# Altium schematic sheet MCU_1.SchDoc
size 420 x 297 mm; DocumentNumber: АЕСН.466369.100Э3; SheetNumber: 5; SheetTotal: x; DocumentName: Sheet1.SCHDOC
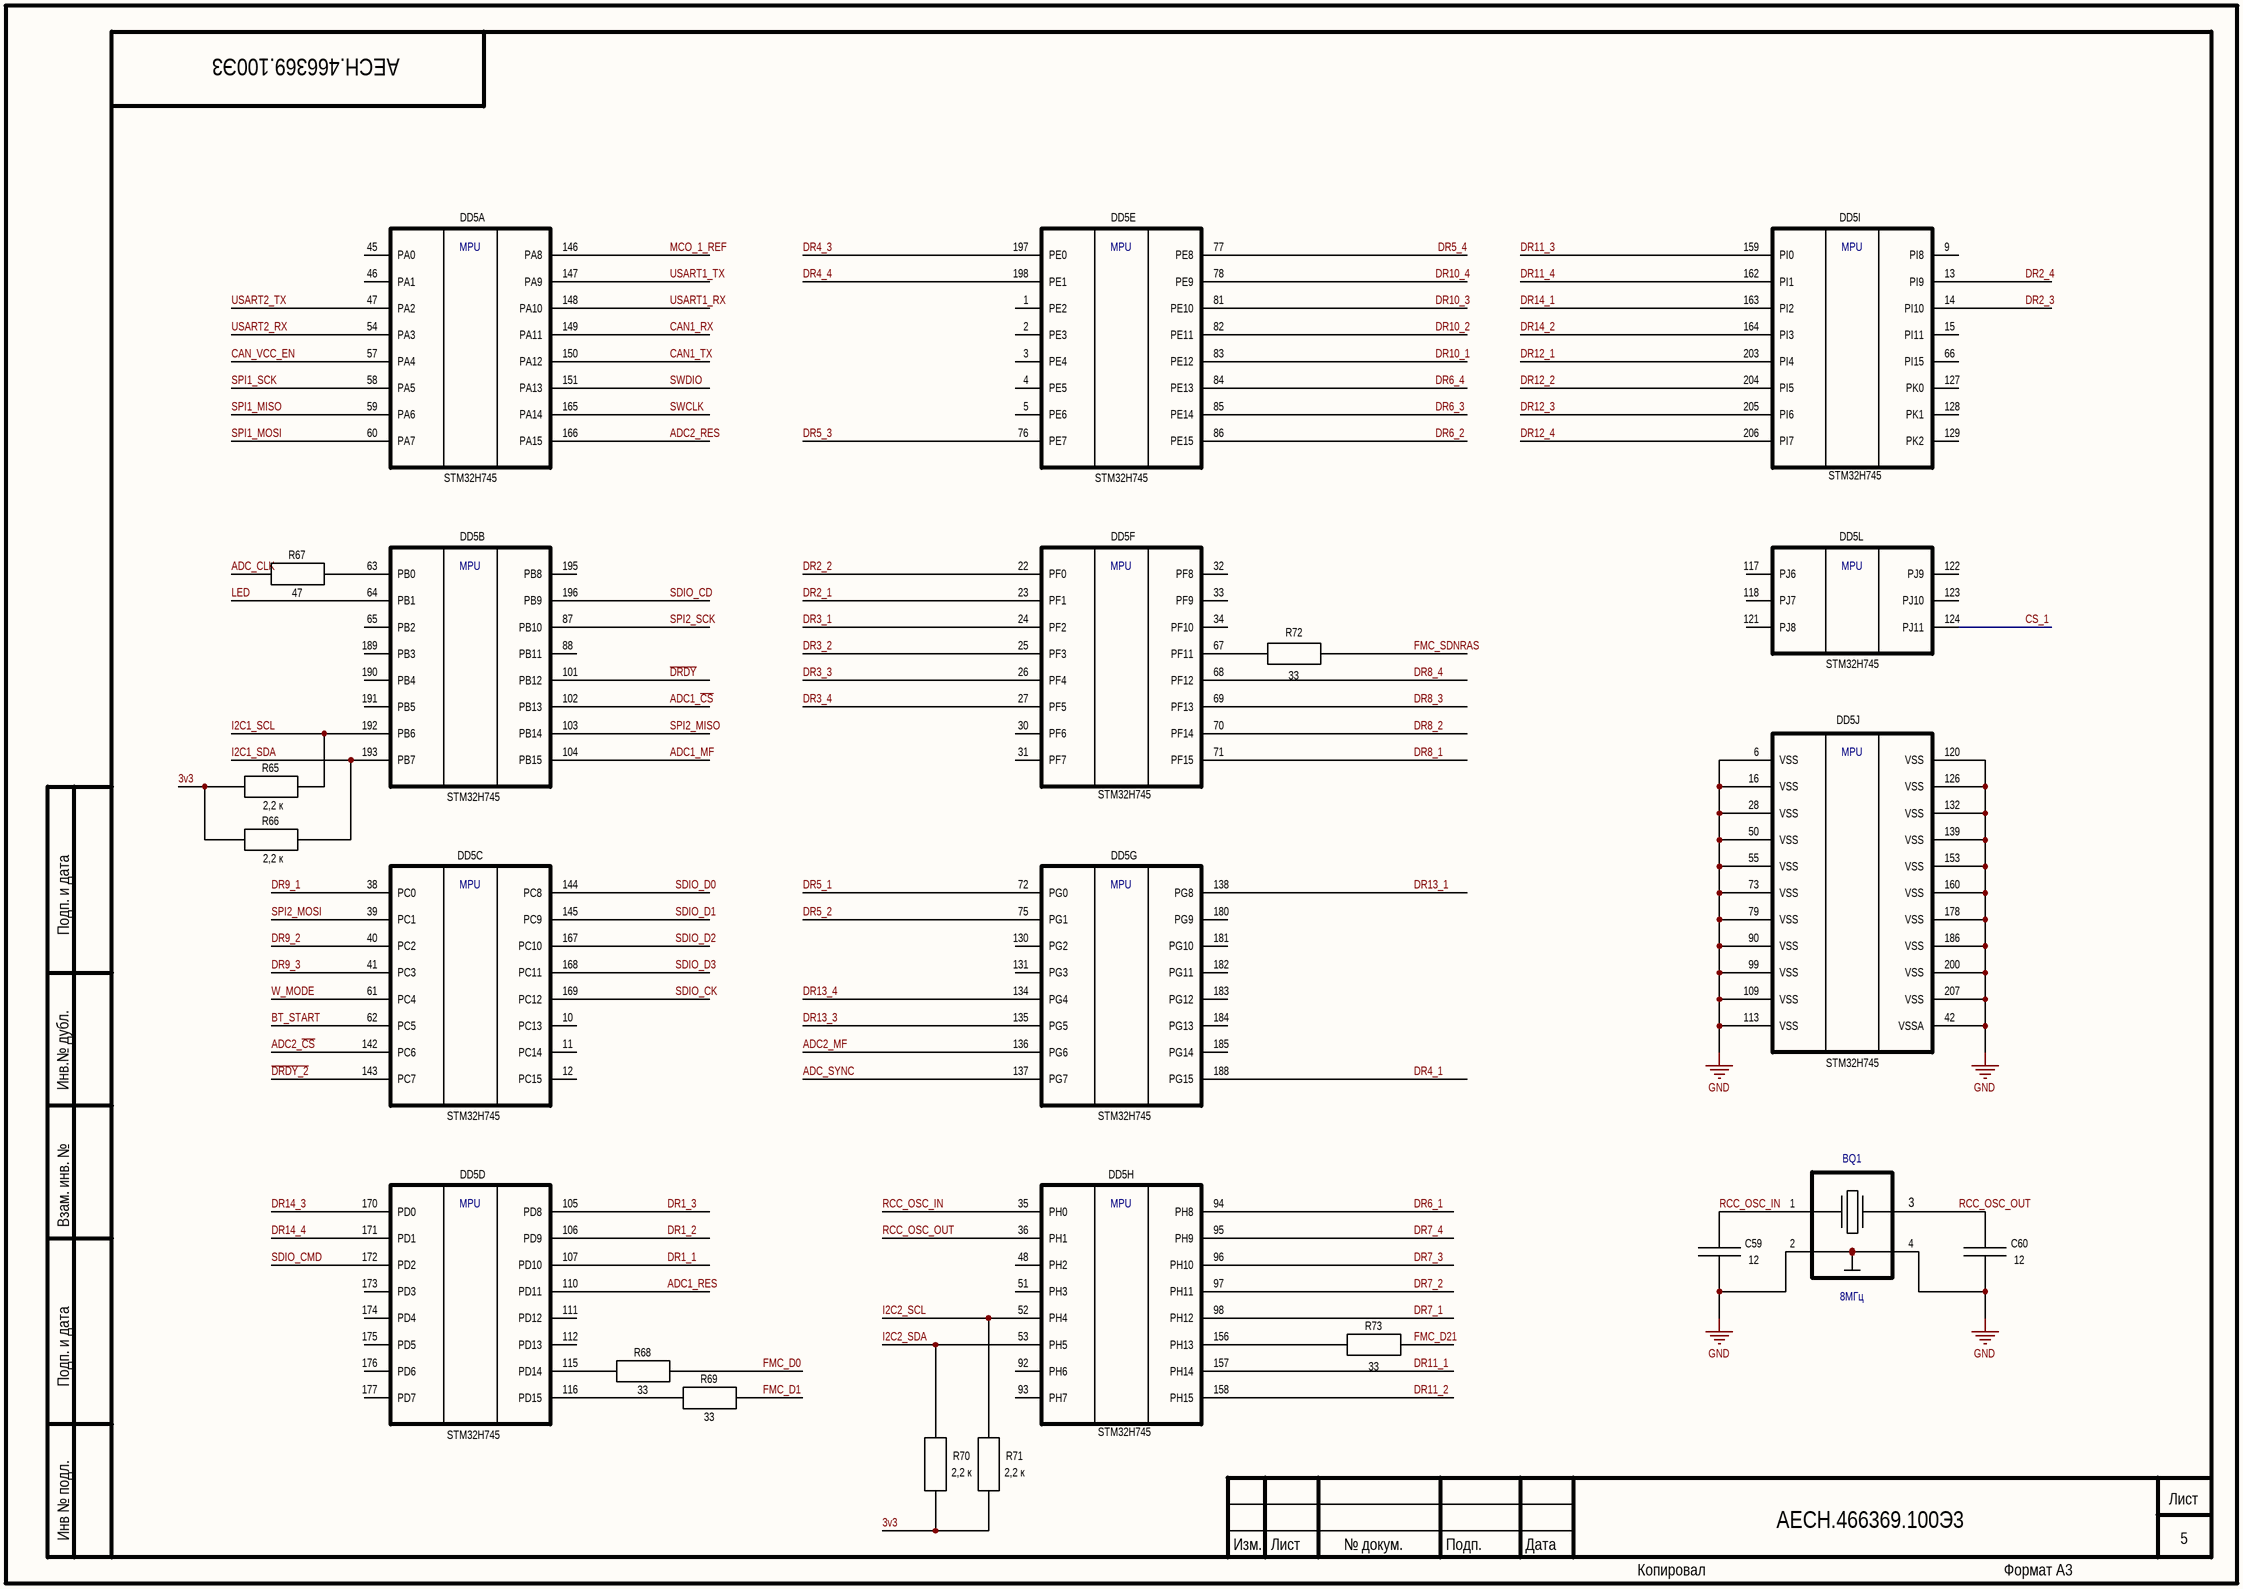
[diagram p0: MCU_1.SchDoc]

## Parts
BQ1  8МГц  [Crystal_0532]
C59  value 12  [C0603]  (hidden comment: C)
C60  value 12  [C0603]  (hidden comment: C)
DD5  STM32H745  [LQFP208]  (parts A,B,C,D,E,F,G,H,I,J,L of 13)
R65  value 2,2 к  [R0603]  (hidden comment: R)
R66  value 2,2 к  [R0603]  (hidden comment: R)
R67  value 47  [R0603]  (hidden comment: R)
R68  value 33  [R0603]  (hidden comment: R)
R69  value 33  [R0603]  (hidden comment: R)
R70  value 2,2 к  [R0603]  (hidden comment: R)
R71  value 2,2 к  [R0603]  (hidden comment: R)
R72  value 33  [R0603]  (hidden comment: R)
R73  value 33  [R0603]  (hidden comment: R)

## Nets
GND: BQ1.2 BQ1.4 C59.2 C60.2 DD5.6(VSS) DD5.16(VSS) DD5.28(VSS) DD5.42(VSSA) DD5.50(VSS) DD5.55(VSS) DD5.73(VSS) DD5.79(VSS) DD5.90(VSS) DD5.99(VSS) DD5.109(VSS) DD5.113(VSS) DD5.120(VSS) DD5.126(VSS) DD5.132(VSS) DD5.139(VSS) DD5.153(VSS) DD5.160(VSS) DD5.178(VSS) DD5.186(VSS) DD5.200(VSS) DD5.207(VSS)
3v3: R65.2 R66.2 R70.2 R71.2
ADC1_~{CS}: DD5.102(PB13)
ADC1_MF: DD5.104(PB15)
ADC1_RES: DD5.110(PD11)
ADC2_~{CS}: DD5.142(PC6)
ADC2_MF: DD5.136(PG6)
ADC2_RES: DD5.166(PA15)
ADC_CLK: R67.1
ADC_SYNC: DD5.137(PG7)
BT_START: DD5.62(PC5)
CAN1_RX: DD5.149(PA11)
CAN1_TX: DD5.150(PA12)
CAN_VCC_EN: DD5.57(PA4)
CS_1: DD5.124(PJ11)
~{DRDY}: DD5.101(PB12)
~{DRDY_2}: DD5.143(PC7)
DR1_1: DD5.107(PD10)
DR1_2: DD5.106(PD9)
DR1_3: DD5.105(PD8)
DR2_1: DD5.23(PF1)
DR2_2: DD5.22(PF0)
DR2_3: DD5.14(PI10)
DR2_4: DD5.13(PI9)
DR3_1: DD5.24(PF2)
DR3_2: DD5.25(PF3)
DR3_3: DD5.26(PF4)
DR3_4: DD5.27(PF5)
DR4_1: DD5.188(PG15)
DR4_3: DD5.197(PE0)
DR4_4: DD5.198(PE1)
DR5_1: DD5.72(PG0)
DR5_2: DD5.75(PG1)
DR5_3: DD5.76(PE7)
DR5_4: DD5.77(PE8)
DR6_1: DD5.94(PH8)
DR6_2: DD5.86(PE15)
DR6_3: DD5.85(PE14)
DR6_4: DD5.84(PE13)
DR7_1: DD5.98(PH12)
DR7_2: DD5.97(PH11)
DR7_3: DD5.96(PH10)
DR7_4: DD5.95(PH9)
DR8_1: DD5.71(PF15)
DR8_2: DD5.70(PF14)
DR8_3: DD5.69(PF13)
DR8_4: DD5.68(PF12)
DR9_1: DD5.38(PC0)
DR9_2: DD5.40(PC2)
DR9_3: DD5.41(PC3)
DR10_1: DD5.83(PE12)
DR10_2: DD5.82(PE11)
DR10_3: DD5.81(PE10)
DR10_4: DD5.78(PE9)
DR11_1: DD5.157(PH14)
DR11_2: DD5.158(PH15)
DR11_3: DD5.159(PI0)
DR11_4: DD5.162(PI1)
DR12_1: DD5.203(PI4)
DR12_2: DD5.204(PI5)
DR12_3: DD5.205(PI6)
DR12_4: DD5.206(PI7)
DR13_1: DD5.138(PG8)
DR13_3: DD5.135(PG5)
DR13_4: DD5.134(PG4)
DR14_1: DD5.163(PI2)
DR14_2: DD5.164(PI3)
DR14_3: DD5.170(PD0)
DR14_4: DD5.171(PD1)
FMC_D0: R68.1
FMC_D1: R69.1
FMC_D21: R73.1
FMC_SDNRAS: R72.1
I2C1_SCL: DD5.192(PB6) R65.1
I2C1_SDA: DD5.193(PB7) R66.1
I2C2_SCL: DD5.52(PH4) R71.1
I2C2_SDA: DD5.53(PH5) R70.1
LED: DD5.64(PB1)
MCO_1_REF: DD5.146(PA8)
RCC_OSC_IN: BQ1.1 C59.1 DD5.35(PH0)
RCC_OSC_OUT: BQ1.3 C60.1 DD5.36(PH1)
SDIO_CD: DD5.196(PB9)
SDIO_CK: DD5.169(PC12)
SDIO_CMD: DD5.172(PD2)
SDIO_D0: DD5.144(PC8)
SDIO_D1: DD5.145(PC9)
SDIO_D2: DD5.167(PC10)
SDIO_D3: DD5.168(PC11)
SPI1_MISO: DD5.59(PA6)
SPI1_MOSI: DD5.60(PA7)
SPI1_SCK: DD5.58(PA5)
SPI2_MISO: DD5.103(PB14)
SPI2_MOSI: DD5.39(PC1)
SPI2_SCK: DD5.87(PB10)
SWCLK: DD5.165(PA14)
SWDIO: DD5.151(PA13)
USART1_RX: DD5.148(PA10)
USART1_TX: DD5.147(PA9)
USART2_RX: DD5.54(PA3)
USART2_TX: DD5.47(PA2)
W_MODE: DD5.61(PC4)
NetDD5_63: DD5.63(PB0) R67.2
NetDD5_67: DD5.67(PF11) R72.2
NetDD5_115: DD5.115(PD14) R68.2
NetDD5_116: DD5.116(PD15) R69.2
NetDD5_156: DD5.156(PH13) R73.2

Not connected (* = marked no-connect by the designer): DD5 1(PE2) 2(PE3) 3(PE4) 4(PE5) 5(PE6) 9(PI8) 10(PC13) 11(PC14) 12(PC15) 15(PI11) 30(PF6) 31(PF7) 32(PF8) 33(PF9) 34(PF10) 45(PA0) 46(PA1) 48(PH2) 51(PH3) 65(PB2) 66(PI15) 88(PB11) 92(PH6) 93(PH7) 111(PD12) 112(PD13) 117(PJ6) 118(PJ7) 121(PJ8) 122(PJ9) 123(PJ10) 127(PK0) 128(PK1) 129(PK2) 130(PG2) 131(PG3) 173(PD3) 174(PD4) 175(PD5) 176(PD6) 177(PD7) 180(PG9) 181(PG10) 182(PG11) 183(PG12) 184(PG13) 185(PG14) 189(PB3) 190(PB4) 191(PB5) 195(PB8)

## Notes on the sheet
- Подп. и дата
- Инв.№ дубл.
- Взам. инв. №
- Инв № подл.
- Изм.
- Лист
- № докум.
- Подп.
- Дата
- Копировал
- Формат А3
- (in symbol STM32H745, part A) MPU
- (in symbol STM32H745, part B) MPU
- (in symbol STM32H745, part C) MPU
- (in symbol STM32H745, part D) MPU
- (in symbol STM32H745, part E) MPU
- (in symbol STM32H745, part F) MPU
- (in symbol STM32H745, part G) MPU
- (in symbol STM32H745, part H) MPU
- (in symbol STM32H745, part I) MPU
- (in symbol STM32H745, part J) MPU
- (in symbol STM32H745, part L) MPU

## Library data of the parts
BQ1 = OSC_4: PartNumber: KX-9AT 8.0 MHZ; Package: QSMD5.0x3.2x1.0; Value: 8МГц
C59 C60 = C: PartNumber: GRM1885C1H120JA01J; Tolerance: ±10%; Voltage: 50 В; Dielectric: NP0; Case: 0603; Mount: *
R65 R66 R70 R71 = R: PartNumber: RC0603JR-072K2L; Tolerance: ±5%; Power: 0.1 Вт; Case: 0603
R67 = R: PartNumber: RC0603JR-0747RL; Tolerance: ±5%; Power: 0.1 Вт; Case: 0603
R68 R69 R72 R73 = R: PartNumber: RC0603JR-0733RL; Tolerance: ±5%; Power: 0.1 Вт; Case: 0603